# EAGLE design SuperUnioc_v1 (EAGLE 6.5.0)
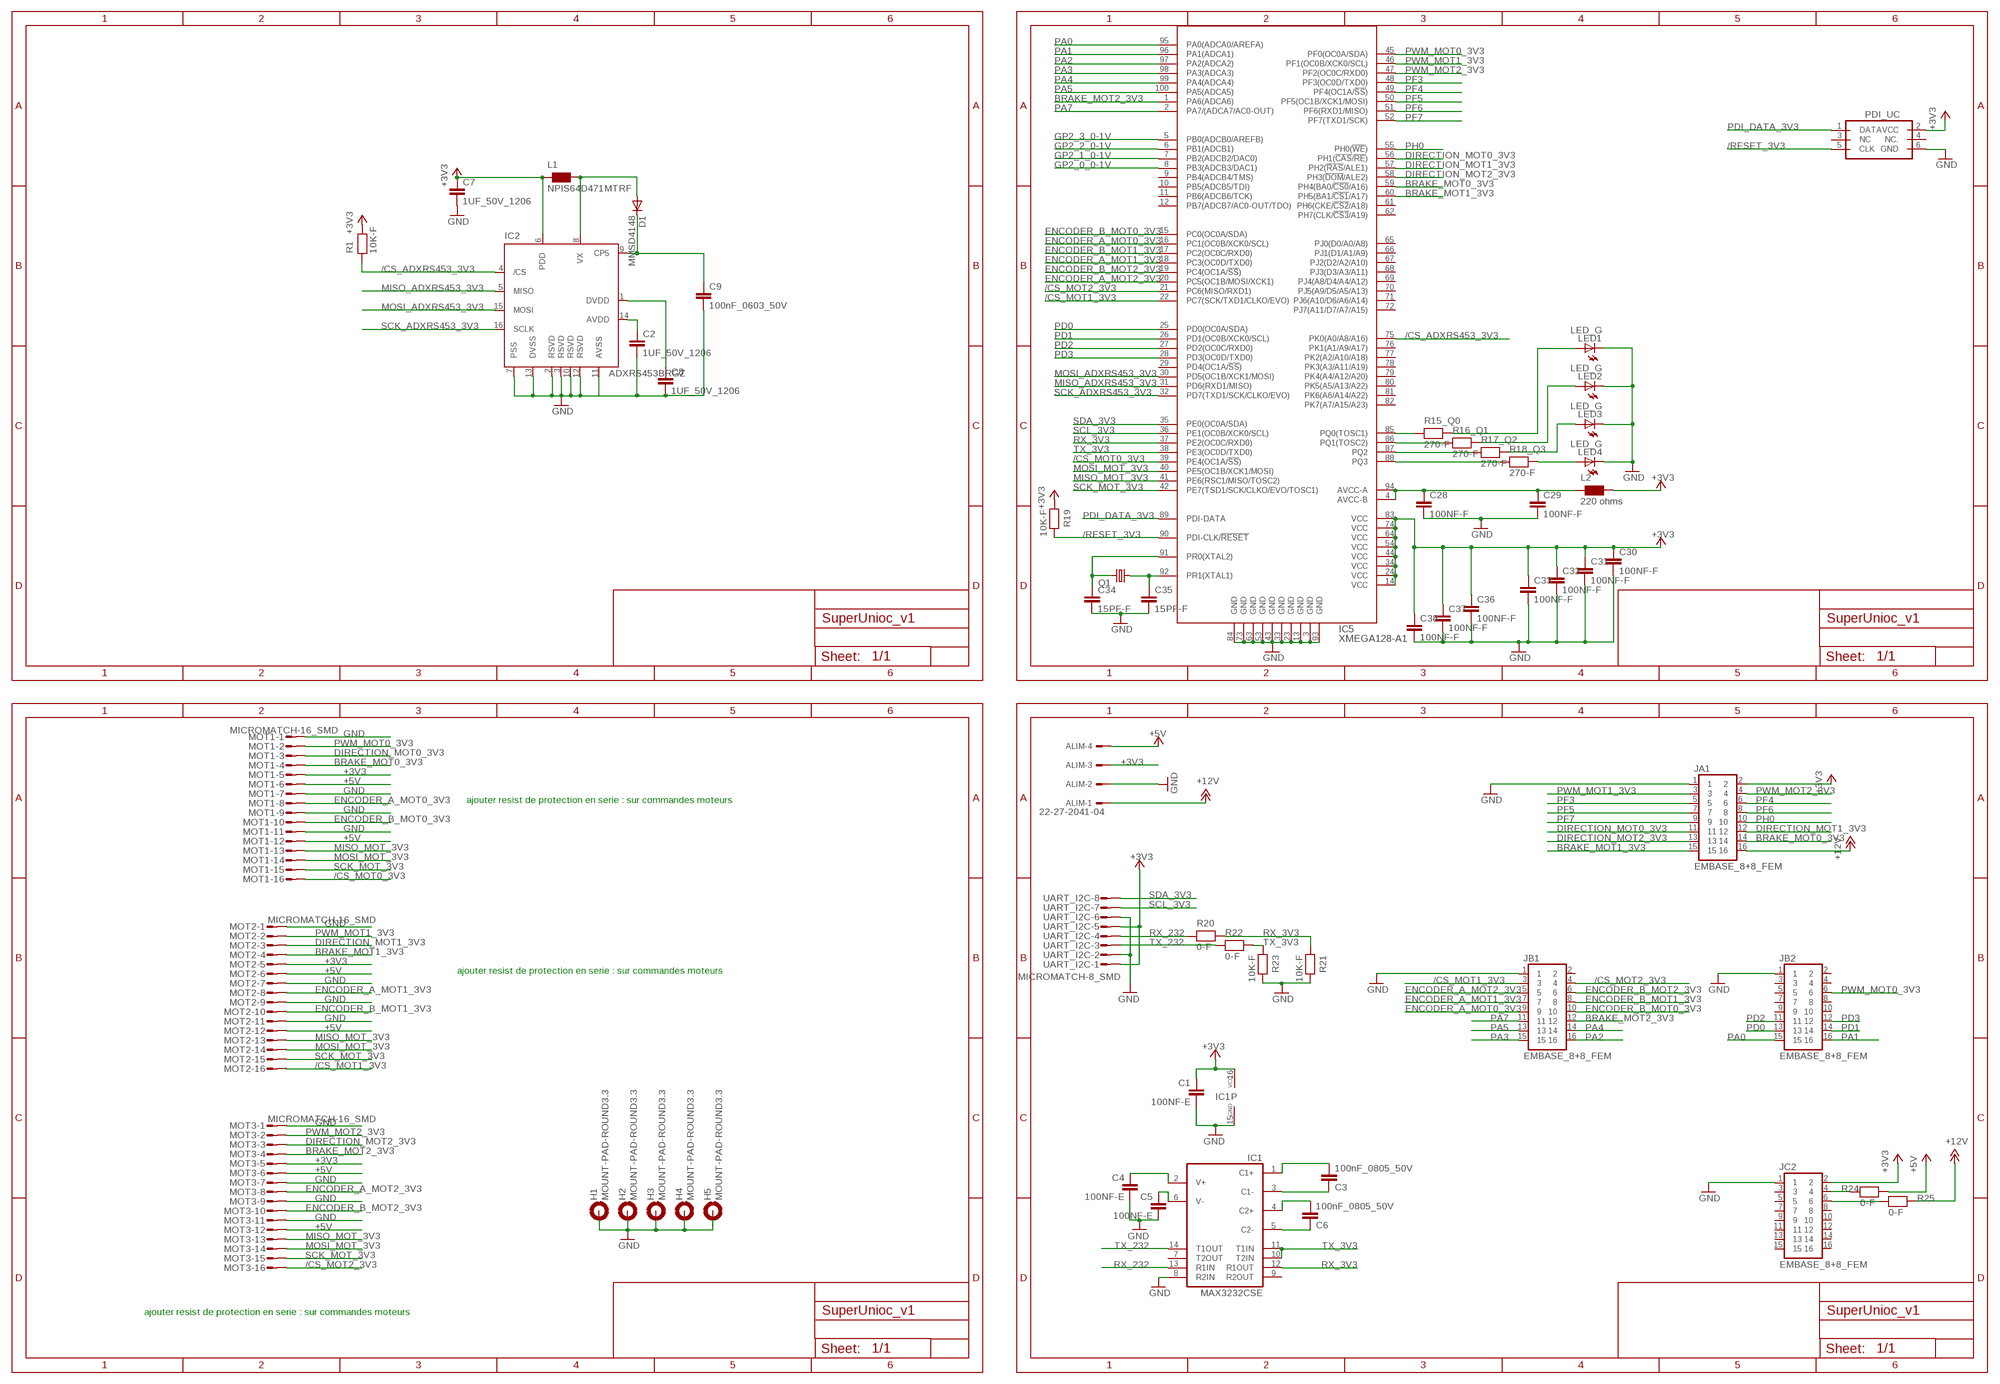
[diagram p0: schematic, sheet 1, part 1 of 2]
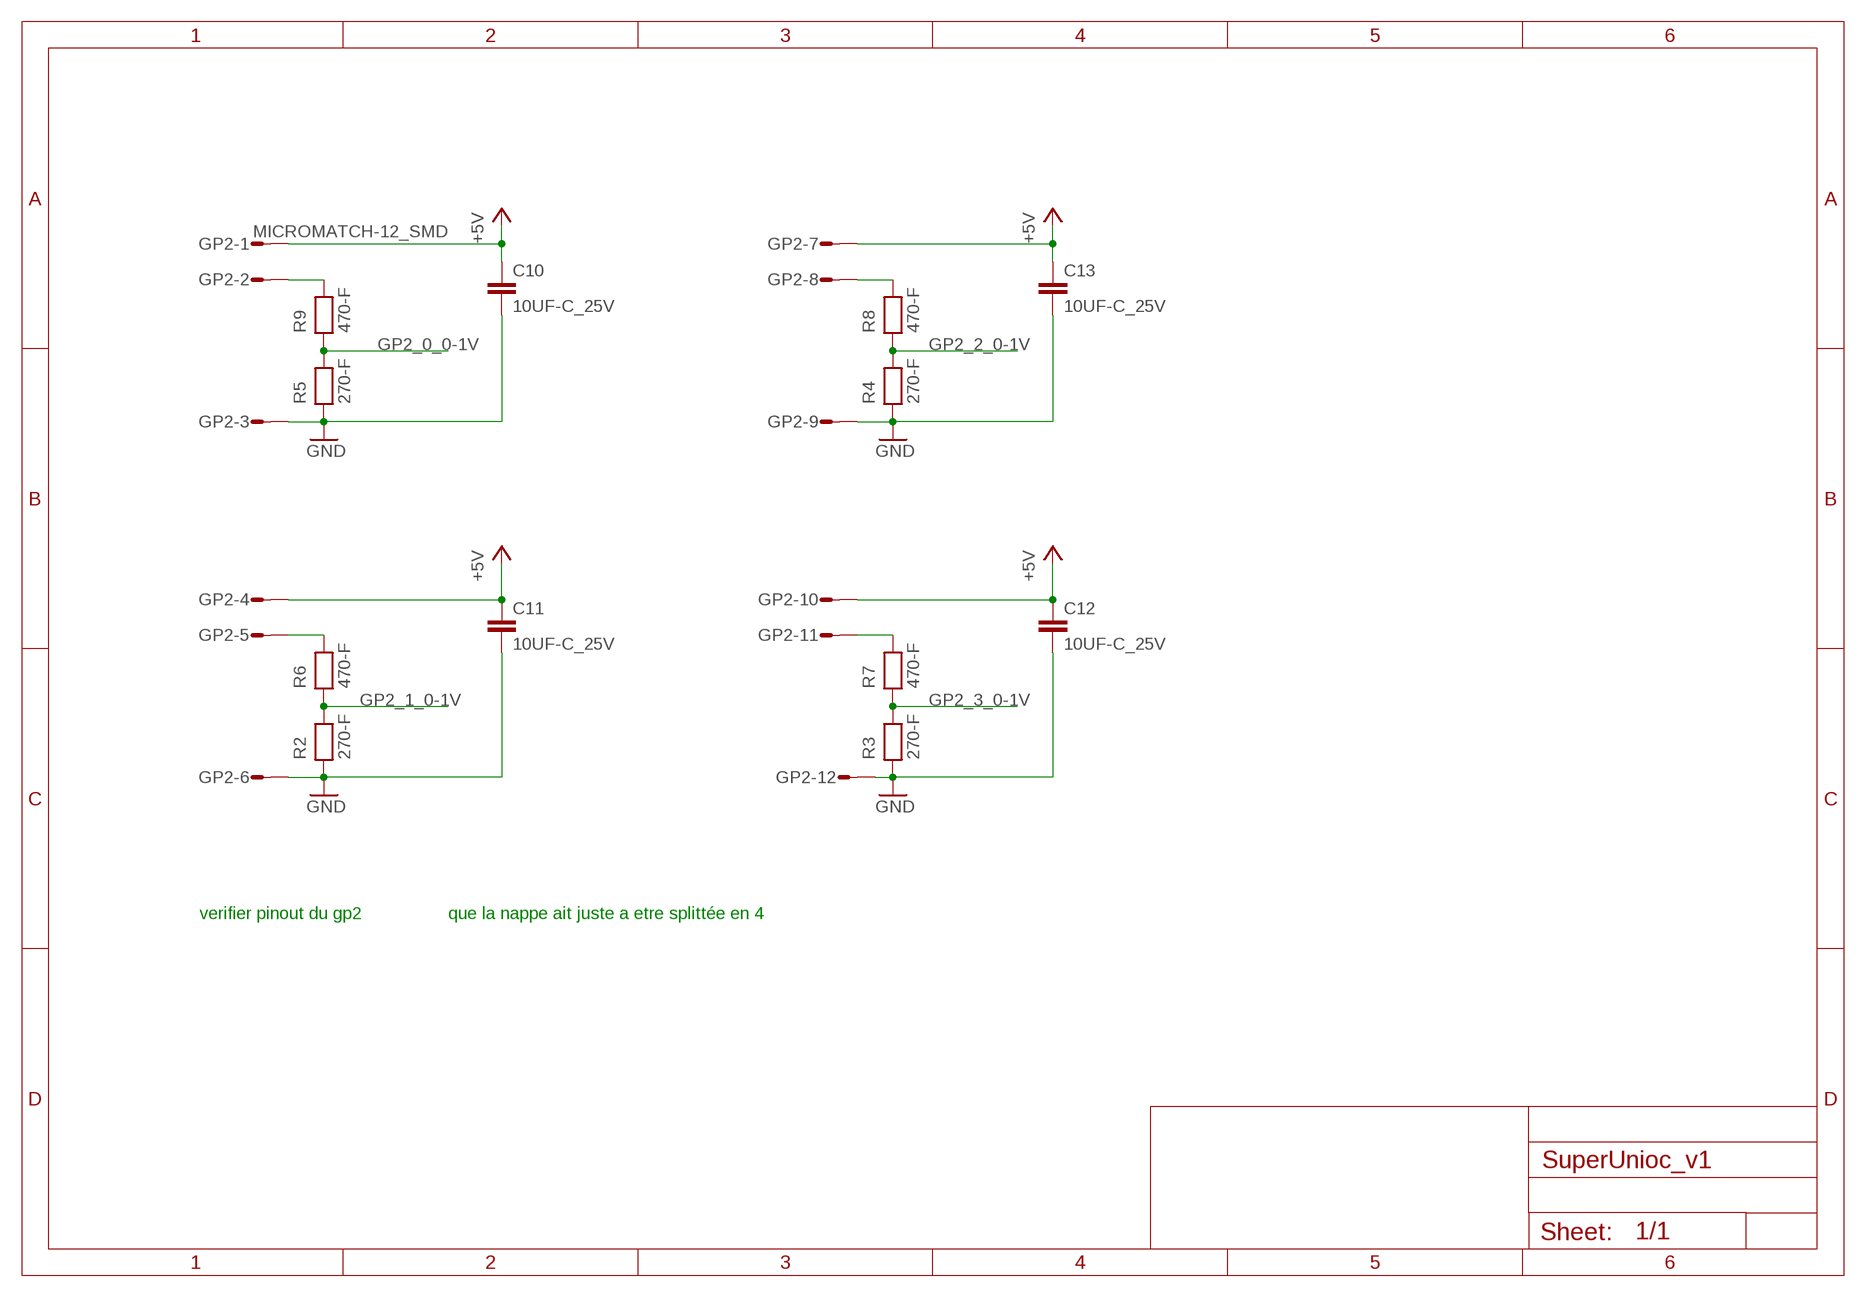
[diagram p1: schematic, sheet 1, part 2 of 2]

## Parts
ALIM  22-27-2041-04  [6410-04]
C1  100NF-E  [C0805]
C2  1UF_50V_1206  1UFD_25V  [C1206]
C3  100nF_0805_50V  100NF-E  [C0805]
C4  100NF-E  [C0805]
C5  100NF-E  [C0805]
C6  100nF_0805_50V  100NF-E  [C0805]
C7  1UF_50V_1206  1UFD_25V  [C1206]
C8  1UF_50V_1206  1UFD_25V  [C1206]
C9  100nF_0603_50V  100NF-F  [C0603]
C10  10UF-C_25V  [C1210]
C11  10UF-C_25V  [C1210]
C12  10UF-C_25V  [C1210]
C13  10UF-C_25V  [C1210]
C28  100NF-F  [C0603]
C29  100NF-F  [C0603]
C30  100NF-F  [C0603]
C31  100NF-F  [C0603]
C32  100NF-F  [C0603]
C33  100NF-F  [C0603]
C34  15PF-F  [C0603]
C35  15PF-F  [C0603]
C36  100NF-F  [C0603]
C37  100NF-F  [C0603]
C38  100NF-F  [C0603]
D1  MMSD4148  MMSD4148'  [SOD123]
GP2  MICROMATCH-12_SMD  [MICROMATCH-12_SMD]
H1  MOUNT-PAD-ROUND3.3  [3,3-PAD]
H2  MOUNT-PAD-ROUND3.3  [3,3-PAD]
H3  MOUNT-PAD-ROUND3.3  [3,3-PAD]
H4  MOUNT-PAD-ROUND3.3  [3,3-PAD]
H5  MOUNT-PAD-ROUND3.3  [3,3-PAD]
IC1  MAX3232CSE  [SO16]
IC2  ADXRS453BRGZ  ADXRS453BRG  [SO16_CAV]
IC5  XMEGA128-A1  XMEGA-A1TQFP  [TQFP100]
JA1  EMBASE_8+8_FEM  [EMBASE_8+8_FEM]
JB1  EMBASE_8+8_FEM  [EMBASE_8+8_FEM]
JB2  EMBASE_8+8_FEM  [EMBASE_8+8_FEM]
JC2  EMBASE_8+8_FEM  [EMBASE_8+8_FEM]
L1  NPIS64D471MTRF  [NPSIS_D64]
L2  220 ohms  FERRITE_220OHMS  [R0603]
LED1  LED_G  [CHIP-LED0805]
LED2  LED_G  [CHIP-LED0805]
LED3  LED_G  [CHIP-LED0805]
LED4  LED_G  [CHIP-LED0805]
MOT1  MICROMATCH-16_SMD  [MICROMATCH-16_SMD]
MOT2  MICROMATCH-16_SMD  [MICROMATCH-16_SMD]
MOT3  MICROMATCH-16_SMD  [MICROMATCH-16_SMD]
PDI_UC  PDI_ATMELL  [ML6L]
Q1  CRYSTAL_16MHZ_HC49UP  [HC49UP]
R1  10K-F  [R0603]
R2  270-F  [R0603]
R3  270-F  [R0603]
R4  270-F  [R0603]
R5  270-F  [R0603]
R6  470-F  [R0603]
R7  470-F  [R0603]
R8  470-F  [R0603]
R9  470-F  [R0603]
R15_Q0  270-F  [R0603]
R16_Q1  270-F  [R0603]
R17_Q2  270-F  [R0603]
R18_Q3  270-F  [R0603]
R19  10K-F  [R0603]
R20  0-F  [R0603]
R21  10K-F  [R0603]
R22  0-F  [R0603]
R23  10K-F  [R0603]
R24  0-F  [R0603]
R25  0-F  [R0603]
UART_I2C  MICROMATCH-8_SMD  [MICROMATCH-8_SMD]

## Nets
+3V3: ALIM.3 C1.1 C7.1 C30.1 C31.1 C32.1 C33.1 C36.1 C37.1 C38.1 IC1.16(VCC) IC2.6(PDD) IC5.14(VCC) IC5.24(VCC) IC5.34(VCC) IC5.44(VCC) IC5.54(VCC) IC5.64(VCC) IC5.74(VCC) IC5.83(VCC) JA1.2 JC2.2 L1.1 L2.2 MOT1.5 MOT2.5 MOT3.5 PDI_UC.2(VCC) R1.2 R19.1 UART_I2C.1 UART_I2C.5
+5V: ALIM.4 C10.1 C11.1 C12.1 C13.1 GP2.1 GP2.4 GP2.7 GP2.10 MOT1.6 MOT1.12 MOT2.6 MOT2.12 MOT3.6 MOT3.12 R24.2
+12V: ALIM.1 JA1.16 R25.2
/CS_ADXRS453_3V3: IC2.4(/CS) IC5.75(PK0(A0/A8/A16)) R1.1
/CS_MOT0_3V3: IC5.39(PE4(OC1A/!SS!)) MOT1.16
/CS_MOT1_3V3: IC5.22(PC7(SCK/TXD1/CLKO/EVO)) JB1.3 MOT2.16
/CS_MOT2_3V3: IC5.21(PC6(MISO/RXD1)) JB1.4 MOT3.16
/RESET_3V3: IC5.90(PDI-CLK/!RESET) PDI_UC.5(CLK) R19.2
BRAKE_MOT0_3V3: IC5.59(PH4(BA0/!CS0!/A16)) JA1.14 MOT1.4
BRAKE_MOT1_3V3: IC5.60(PH5(BA1/!CS1!/A17)) JA1.15 MOT2.4
BRAKE_MOT2_3V3: IC5.1(PA6(ADCA6)) JB1.12 MOT3.4
DIRECTION_MOT0_3V3: IC5.56(PH1(!CAS!/!RE!)) JA1.11 MOT1.3
DIRECTION_MOT1_3V3: IC5.57(PH2(!RAS!/ALE1)) JA1.12 MOT2.3
DIRECTION_MOT2_3V3: IC5.58(PH3(!DOM!/ALE2)) JA1.13 MOT3.3
ENCODER_A_MOT0_3V3: IC5.16(PC1(OC0B/XCK0/SCL)) JB1.9 MOT1.8
ENCODER_A_MOT1_3V3: IC5.18(PC3(OC0D/TXD0)) JB1.7 MOT2.8
ENCODER_A_MOT2_3V3: IC5.20(PC5(OC1B/MOSI/XCK1)) JB1.5 MOT3.8
ENCODER_B_MOT0_3V3: IC5.15(PC0(OC0A/SDA)) JB1.10 MOT1.10
ENCODER_B_MOT1_3V3: IC5.17(PC2(OC0C/RXD0)) JB1.8 MOT2.10
ENCODER_B_MOT2_3V3: IC5.19(PC4(OC1A/!SS!)) JB1.6 MOT3.10
GND: ALIM.2 C1.2 C2.2 C4.2 C5.2 C7.2 C8.2 C9.2 C10.2 C11.2 C12.2 C13.2 C28.2 C29.2 C30.2 C31.2 C32.2 C33.2 C34.2 C35.2 C36.2 C37.2 C38.2 GP2.3 GP2.6 GP2.9 GP2.12 H1.B3,3(MOUNT) H2.B3,3(MOUNT) H3.B3,3(MOUNT) H4.B3,3(MOUNT) H5.B3,3(MOUNT) IC1.8(R2IN) IC1.15(GND) IC2.2(RSVD) IC2.3(RSVD) IC2.7(PSS) IC2.10(RSVD) IC2.11(AVSS) IC2.12(RSVD) IC2.13(DVSS) IC5.3(GND) IC5.13(GND) IC5.23(GND) IC5.33(GND) IC5.43(GND) IC5.53(GND) IC5.63(GND) IC5.73(GND) IC5.84(GND) IC5.93(GND) JA1.1 JB1.1 JB2.1 JC2.1 LED1.C LED2.C LED3.C LED4.C MOT1.1 MOT1.7 MOT1.9 MOT1.11 MOT2.1 MOT2.7 MOT2.9 MOT2.11 MOT3.1 MOT3.7 MOT3.9 MOT3.11 PDI_UC.6(GND) R2.1 R3.1 R4.1 R5.1 R21.2 R23.2 UART_I2C.2 UART_I2C.6
GP2_0_0-1V: IC5.8(PB3(ADCB3/DAC1)) R5.2 R9.1
GP2_1_0-1V: IC5.7(PB2(ADCB2/DAC0)) R2.2 R6.1
GP2_2_0-1V: IC5.6(PB1(ADCB1)) R4.2 R8.1
GP2_3_0-1V: IC5.5(PB0(ADCB0/AREFB)) R3.2 R7.1
MISO_ADXRS453_3V3: IC2.5(MISO) IC5.31(PD6(RXD1/MISO))
MISO_MOT_3V3: IC5.41(PE6(RSC1/MISO/TOSC2)) MOT1.13 MOT2.13 MOT3.13
MOSI_ADXRS453_3V3: IC2.15(MOSI) IC5.30(PD5(OC1B/XCK1/MOSI))
MOSI_MOT_3V3: IC5.40(PE5(OC1B/XCK1/MOSI)) MOT1.14 MOT2.14 MOT3.14
N$1: JC2.4 R24.1
N$2: C3.1 IC1.1(C1+)
N$3: C6.1 IC1.4(C2+)
N$4: LED4.A R18_Q3.2
N$5: C3.2 IC1.3(C1-)
N$6: IC5.88(PQ3) R18_Q3.1
N$7: C34.1 IC5.91(PR0(XTAL2)) Q1.2
N$8: C35.1 IC5.92(PR1(XTAL1)) Q1.1
N$9: IC5.87(PQ2) R17_Q2.1
N$10: IC5.86(PQ1(TOSC2)) R16_Q1.1
N$11: IC5.85(PQ0(TOSC1)) R15_Q0.1
N$12: LED1.A R15_Q0.2
N$13: LED2.A R16_Q1.2
N$14: LED3.A R17_Q2.2
N$15: JC2.6 R25.1
N$16: C6.2 IC1.5(C2-)
N$17: C4.1 IC1.2(V+)
N$18: D1.A IC2.8(VX) L1.2
N$19: C2.1 IC2.14(AVDD)
N$20: C5.1 IC1.6(V-)
N$21: C8.1 IC2.1(DVDD)
N$22: GP2.8 R8.2
N$23: C9.1 D1.C IC2.9(CP5)
N$24: GP2.2 R9.2
N$25: C28.1 C29.1 IC5.4(AVCC-B) IC5.94(AVCC-A) L2.1
N$36: GP2.11 R7.2
N$37: GP2.5 R6.2
PA0: IC5.95(PA0(ADCA0/AREFA)) JB2.15
PA1: IC5.96(PA1(ADCA1)) JB2.16
PA2: IC5.97(PA2(ADCA2)) JB1.16
PA3: IC5.98(PA3(ADCA3)) JB1.15
PA4: IC5.99(PA4(ADCA4)) JB1.14
PA5: IC5.100(PA5(ADCA5)) JB1.13
PA7: IC5.2(PA7/(ADCA7/AC0-OUT)) JB1.11
PD0: IC5.25(PD0(OC0A/SDA)) JB2.13
PD1: IC5.26(PD1(OC0B/XCK0/SCL)) JB2.14
PD2: IC5.27(PD2(OC0C/RXD0)) JB2.11
PD3: IC5.28(PD3(OC0D/TXD0)) JB2.12
PDI_DATA_3V3: IC5.89(PDI-DATA) PDI_UC.1(DATA)
PF3: IC5.48(PF3(OC0D/TXD0)) JA1.5
PF4: IC5.49(PF4(OC1A/!SS!)) JA1.6
PF5: IC5.50(PF5(OC1B/XCK1/MOSI)) JA1.7
PF6: IC5.51(PF6(RXD1/MISO)) JA1.8
PF7: IC5.52(PF7(TXD1/SCK)) JA1.9
PH0: IC5.55(PH0(!WE!)) JA1.10
PWM_MOT0_3V3: IC5.45(PF0(OC0A/SDA)) JB2.6 MOT1.2
PWM_MOT1_3V3: IC5.46(PF1(OC0B/XCK0/SCL)) JA1.3 MOT2.2
PWM_MOT2_3V3: IC5.47(PF2(OC0C/RXD0)) JA1.4 MOT3.2
RX_3V3: IC1.12(R1OUT) IC5.37(PE2(OC0C/RXD0)) R20.2 R21.1
RX_232: IC1.13(R1IN) R20.1 UART_I2C.4
SCK_ADXRS453_3V3: IC2.16(SCLK) IC5.32(PD7(TXD1/SCK/CLKO/EVO))
SCK_MOT_3V3: IC5.42(PE7(TSD1/SCK/CLKO/EVO/TOSC1)) MOT1.15 MOT2.15 MOT3.15
SCL_3V3: IC5.36(PE1(OC0B/XCK0/SCL)) UART_I2C.7
SDA_3V3: IC5.35(PE0(OC0A/SDA)) UART_I2C.8
TX_3V3: IC1.10(T2IN) IC1.11(T1IN) IC5.38(PE3(OC0D/TXD0)) R22.2 R23.1
TX_232: IC1.14(T1OUT) R22.1 UART_I2C.3
Unconnected: IC1.7(T2OUT) IC1.9(R2OUT) IC5.9(PB4(ADCB4/TMS)) IC5.10(PB5(ADCB5/TDI)) IC5.11(PB6(ADCB6/TCK)) IC5.12(PB7(ADCB7/AC0-OUT/TDO)) IC5.29(PD4(OC1A/!SS!)) IC5.61(PH6(CKE/!CS2!/A18)) IC5.62(PH7(CLK/!CS3!/A19)) IC5.65(PJ0(D0/A0/A8)) IC5.66(PJ1(D1/A1/A9)) IC5.67(PJ2(D2/A2/A10)) IC5.68(PJ3(D3/A3/A11)) IC5.69(PJ4(A8/D4/A4/A12)) IC5.70(PJ5(A9/D5/A5/A13)) IC5.71(PJ6(A10/D6/A6/A14)) IC5.72(PJ7(A11/D7/A7/A15)) IC5.76(PK1(A1/A9/A17)) IC5.77(PK2(A2/A10/A18)) IC5.78(PK3(A3/A11/A19)) IC5.79(PK4(A4/A12/A20)) IC5.80(PK5(A5/A13/A22)) IC5.81(PK6(A6/A14/A22)) IC5.82(PK7(A7/A15/A23)) JB1.2 JB2.2 JB2.3 JB2.4 JB2.5 JB2.7 JB2.8 JB2.9 JB2.10 JC2.3 JC2.5 JC2.7 JC2.8 JC2.9 JC2.10 JC2.11 JC2.12 JC2.13 JC2.14 JC2.15 JC2.16 PDI_UC.3(NC) PDI_UC.4(NC.)

## Notes on the sheet
- ajouter resist de protection en serie : sur commandes moteurs
- ajouter resist de protection en serie : sur commandes moteurs
- ajouter resist de protection en serie : sur commandes moteurs
- verifier pinout du gp2 | que la nappe ait juste a etre splittée en 4

## Library data of the parts
ALIM = con-molex:22-?-04: CONNECTOR wire to board 2.54 mm (.1 inch) pitch header; OC_FARNELL: unknown; OC_NEWARK: unknown
C1 C3-C6 = robotter_capacitor:100NF; MOUSER: 81-GRM40Y104Z50D; RS: 220-7966; VALUE: 100nF 50V
C2 C7 C8 = robotter_capacitor:1UF; MOUSER: 810-C3216X7R1E105K-6; RS: 740-7574; VALUE: 1µF 25V
C9 C28-C33 C36-C38 = robotter_capacitor:100NF; MOUSER: 81-GRM188F51H104ZA01; RS: 723-5534; VALUE: 100nF 50V
C10-C13 = robotter_capacitor:10UF; MOUSER: 963-TMK316BJ106KL-T; RS: 766-1185; VALUE: 10µF 25V
C34 C35 = robotter_capacitor:15PF; MOUSER: 581-06031A150K4T2A; RS: 147-421; VALUE: 15pF_0603_100V
D1 = robotter_ic:MMSD4148; MOUSER: 863-MMSD4148T1G; RS: 464-198
GP2 = robotter_connector:MICROMATCH-12_SMD: Ref FN : 1565589; MOUSER: 571-8-188275-2; RS: 739-1230
H1-H5 = holes:MOUNT-PAD-ROUND: MOUNTING PAD, round
IC1 = robotter_ic:MAX3232: True RS-232 Transceivers 3.0V to 5.5V, Low-Power up to 1Mbps, Using Four 0.1µF External Capacitors Source: http://pdfserv.maxim-ic.com/en/ds/MAX3222-MAX3241.pdf; MOUSER: 511-ST3232CDR; RS: 415-2105
IC2 = robotter_ic:ADXRS453; FARNELL: 2377130; MOUSER: 584-ADXRS453BRGZ
IC5 = avr-7:XMEGA-A1: Atmel XMega A1 Series processor
JA1 JB1 JB2 JC2 = robotter_connector:EMBASE_8+8_FEM; FARNELL: 1109794; MOUSER: 855-M22-7140842; RS: 605-8847
L1 = robotter_inductor:NPIS64D; RS: 741-9271
L2 = robotter_inductor:FERRITE_220OHMS; MOUSER: 81-BLM18BB221SN1D; RS: 724-1302
LED1-LED4 = robotter_diode:LED_; MOUSER: 859-LTST-C171GKT; RS: 692-0935; VALUE: GREEN
MOT1-MOT3 = robotter_connector:MICROMATCH-16_SMD: MicroMaTch 16 FN : 1565592 / 8-215464-6 / 1-215464-6 Drawing Number C-215464 DDEController.pdf; MOUSER: 571-8-188275-6; RS: 739-1237
PDI_UC = robotter_connector:PDI_ATMEL: Ref Harting : 09 18 506 7323 Atmel pdi connector; MOUSER: 617-09-18-506-7323; RS: 693-5242
Q1 = robotter_ic:CRYSTAL_: CRYSTAL; MOUSER: 559-FOXSD160-20-LF; RS: 547-6531; VALUE: 16 MHz
R1 R19 R21 R23 = robotter_resistor:10K; MOUSER: 652-CR0603-JW-103ELF; RS: 740-8899
R2-R5 R15_Q0 R16_Q1 R17_Q2 R18_Q3 = robotter_resistor:270; MOUSER: 71-CRCW0603J-270-E3; RS: 679-0071
R6-R9 = robotter_resistor:470; MOUSER: 279-CRG0603F470R; RS: 213-2222; VALUE: 470
R20 R22 R24 R25 = robotter_resistor:0
UART_I2C = robotter_connector:MICROMATCH-8_SMD: Ref FN : 1865096; FARNELL: 1865096; MOUSER: 571-7-188275-8; RS: 739-1227

## Board
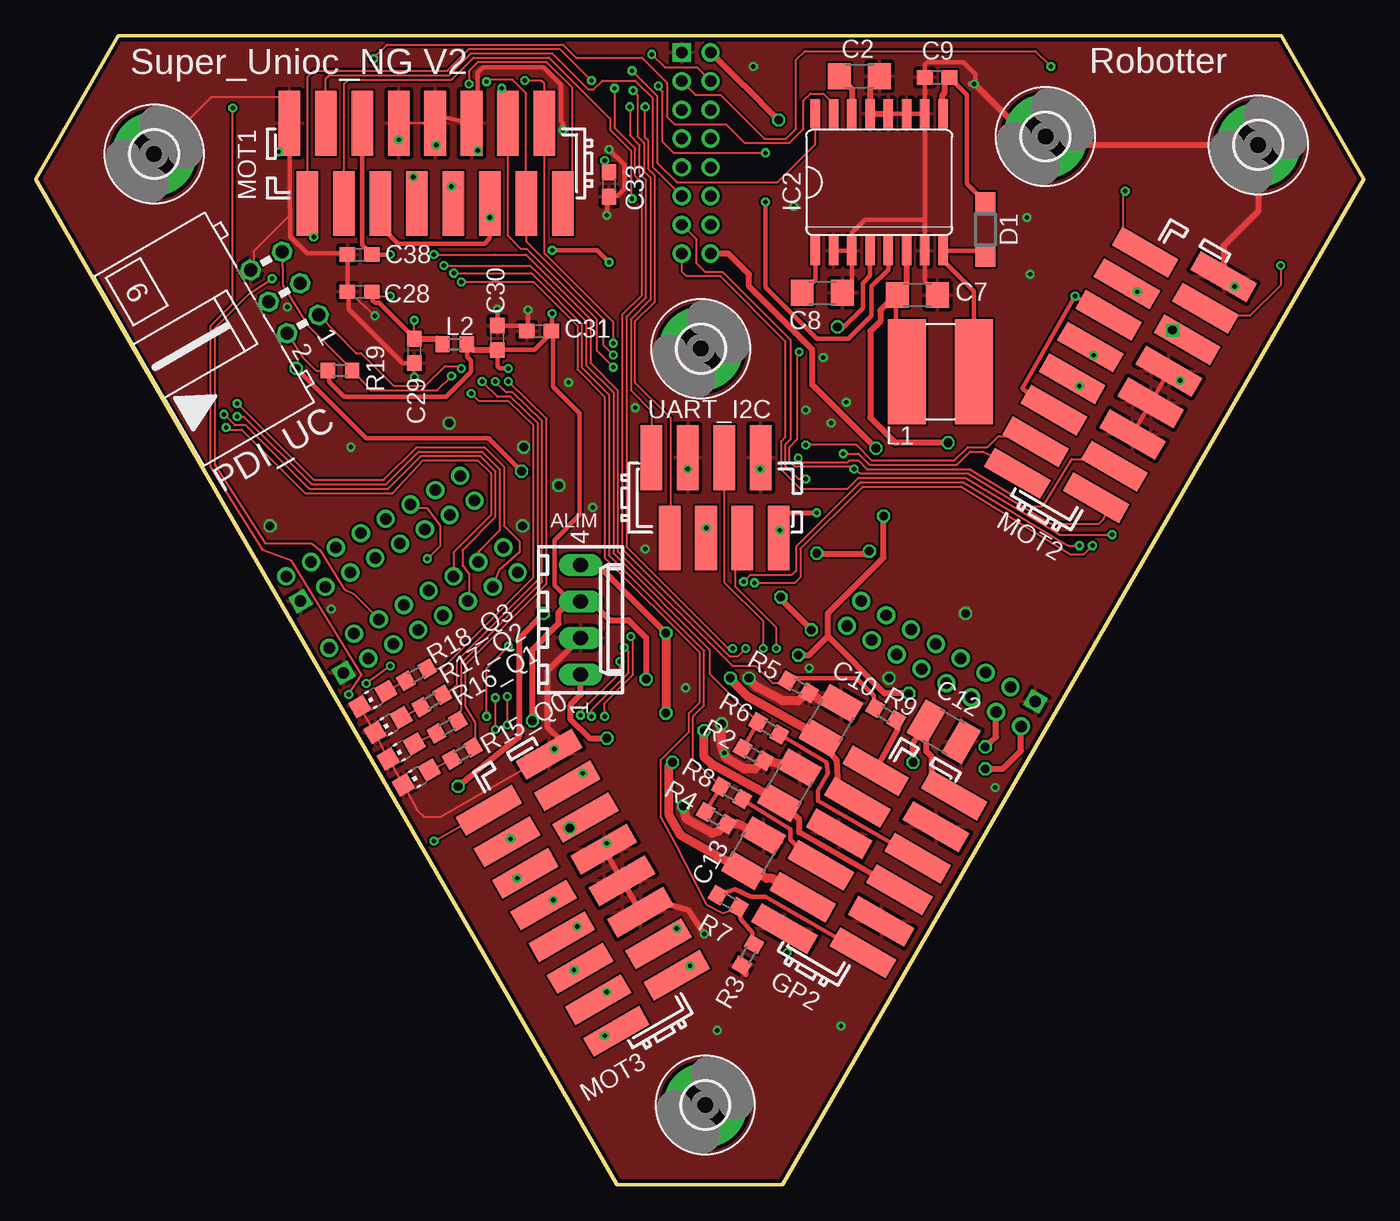
[diagram p2: board, top side]
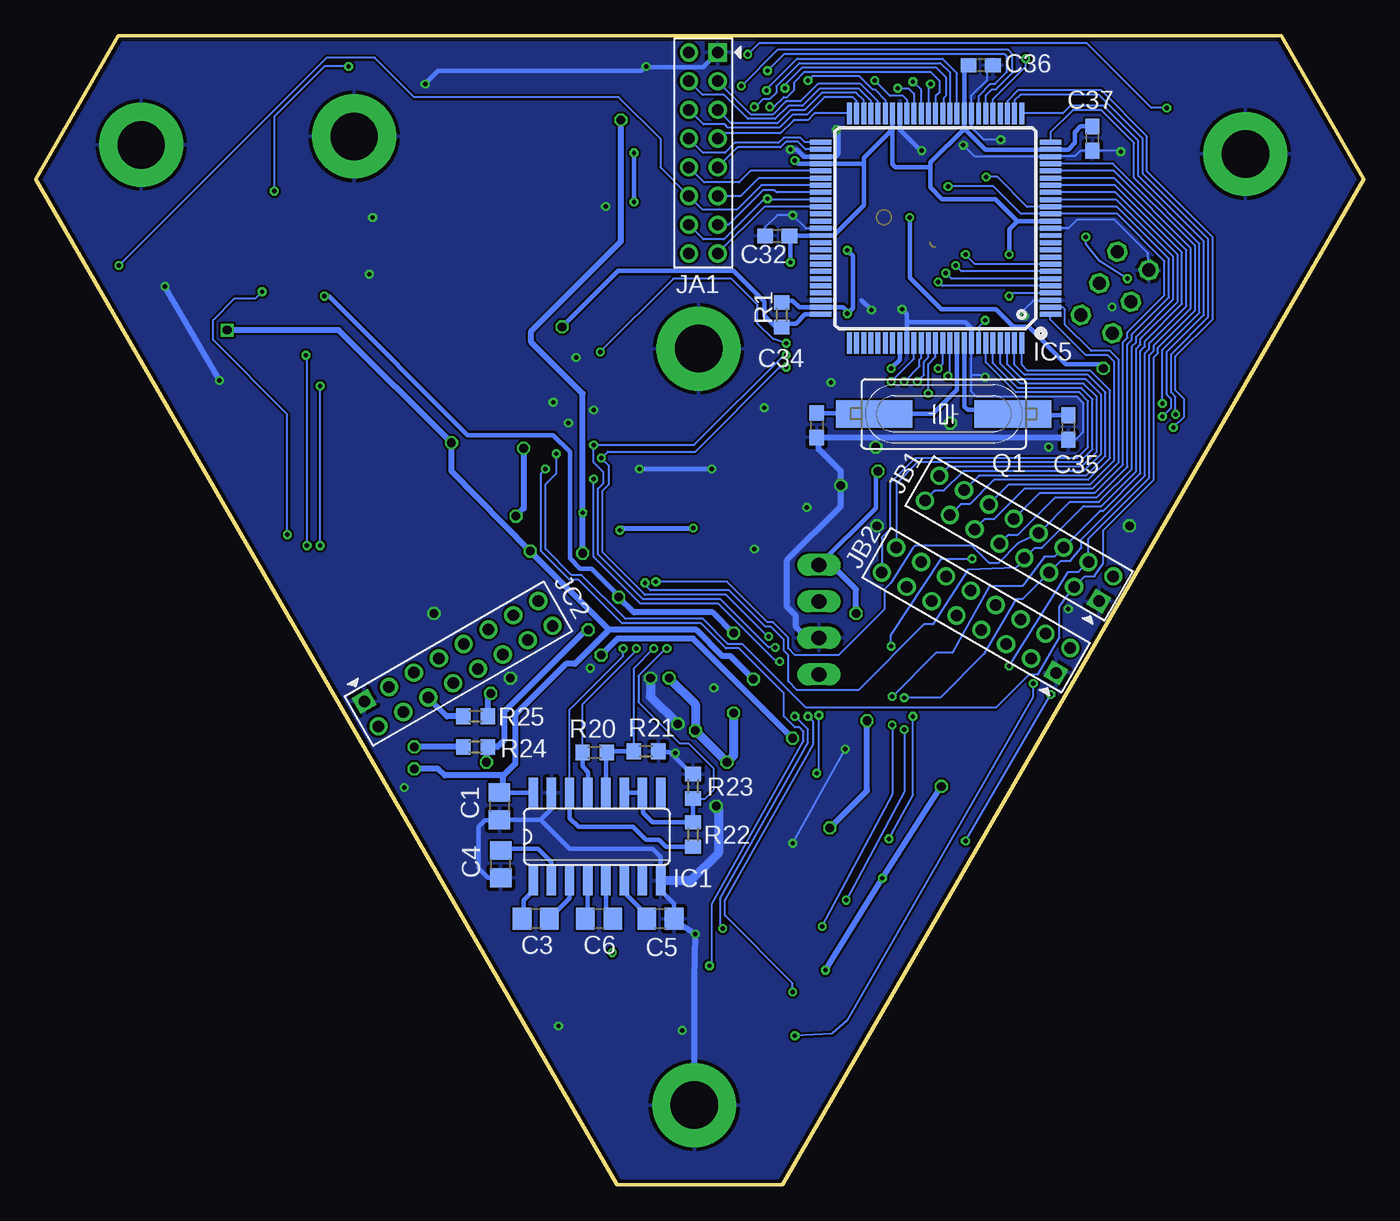
[diagram p3: board, bottom side, seen from below]

Size 92.5 x 80 mm. Coordinates in mm from the lower left corner, seen from the top.
Outline: 5.75,80 86.75,80 92.5,70 52,0 40.5,0 0,70 5.75,80
Copper layers (1*16): Top 0.035mm / dielectric 1.6mm / Bottom 0.035mm
Design rules "SeeedStudio_DRU_2layer": minimum track width 6mil, minimum drill 12mil, track to track 6mil, track to pad 6mil, pad to pad 6mil, via to via 6mil, smd to smd 0mil, copper to edge 10mil, drill to drill 10mil, minimum pad ring 6mil, minimum via ring 6mil, stop-mask expansion 2mil, vias tented up to drill 25mil, thermal gap 10mil

### Footprints (pad centres in the part's own frame; a part is rotated, then mirrored left to right if it is on the bottom)
6410-04 = drill 1.016 long: 1 3.81,0; 2 1.27,0; 3 -1.27,0; 4 -3.81,0
C0805 = smd 1.3 x 1.5: 1 -0.95,0; 2 0.95,0
C1206 = smd 1.6 x 1.8: 1 -1.4,0; 2 1.4,0
C0603 = smd 1.1 x 1: 1 -0.85,0; 2 0.85,0
C1210 = smd 1.6 x 2.7: 1 -1.4,0; 2 1.4,0
SOD123 = smd 1.4 x 1.4: A 1.9,0; C -1.9,0
MICROMATCH-12_SMD = smd 1.5 x 4.5: 1 6.985,-2.794; 2 5.715,2.794; 3 4.445,-2.794; 4 3.175,2.794; 5 1.905,-2.794; 6 0.635,2.794; 7 -0.635,-2.794; 8 -1.905,2.794; 9 -3.175,-2.794; 10 -4.445,2.794; 11 -5.715,-2.794; 12 -6.985,2.794
3,3-PAD = drill 3.3 pad 5.842: B3,3 0,0
SO16 = smd 0.66 x 2.032: 1 -4.445,-3.073; 2 -3.175,-3.073; 3 -1.905,-3.073; 4 -0.635,-3.073; 5 0.635,-3.073; 6 1.905,-3.073; 7 3.175,-3.073; 8 4.445,-3.073; 9 4.445,3.073; 10 3.175,3.073; 11 1.905,3.073; 12 0.635,3.073; 13 -0.635,3.073; 14 -1.905,3.073; 15 -3.175,3.073; 16 -4.445,3.073
SO16_CAV = smd 0.66 x 2.032: 1 -4.445,-4.77; 2 -3.175,-4.77; 3 -1.905,-4.77; 4 -0.635,-4.77; 5 0.635,-4.77; 6 1.905,-4.77; 7 3.175,-4.77; 8 4.445,-4.77; 9 4.445,4.77; 10 3.175,4.77; 11 1.905,4.77; 12 0.635,4.77; 13 -0.635,4.77; 14 -1.905,4.77; 15 -3.175,4.77; 16 -4.445,4.77
TQFP100 = smd 1.5 x 0.347: 1 -8,6; 2 -8,5.5; 3 -8,5; 4 -8,4.5; 5 -8,4; 6 -8,3.5; 7 -8,3; 8 -8,2.5; 9 -8,2; 10 -8,1.5; 11 -8,1; 12 -8,0.5; 13 -8,0; 14 -8,-0.5; 15 -8,-1; 16 -8,-1.5; 17 -8,-2; 18 -8,-2.5; 19 -8,-3; 20 -8,-3.5; 21 -8,-4; 22 -8,-4.5; 23 -8,-5; 24 -8,-5.5; 25 -8,-6; 51 8,-6; 52 8,-5.5; 53 8,-5; 54 8,-4.5; 55 8,-4; 56 8,-3.5; 57 8,-3; 58 8,-2.5; 59 8,-2; 60 8,-1.5; 61 8,-1; 62 8,-0.5; 63 8,0; 64 8,0.5; 65 8,1; 66 8,1.5; 67 8,2; 68 8,2.5; 69 8,3; 70 8,3.5; 71 8,4; 72 8,4.5; 73 8,5; 74 8,5.5; 75 8,6 | smd 0.347 x 1.5: 26 -6,-8; 27 -5.5,-8; 28 -5,-8; 29 -4.5,-8; 30 -4,-8; 31 -3.5,-8; 32 -3,-8; 33 -2.5,-8; 34 -2,-8; 35 -1.5,-8; 36 -1,-8; 37 -0.5,-8; 38 0,-8; 39 0.5,-8; 40 1,-8; 41 1.5,-8; 42 2,-8; 43 2.5,-8; 44 3,-8; 45 3.5,-8; 46 4,-8; 47 4.5,-8; 48 5,-8; 49 5.5,-8; 50 6,-8; 76 6,8; 77 5.5,8; 78 5,8; 79 4.5,8; 80 4,8; 81 3.5,8; 82 3,8; 83 2.5,8; 84 2,8; 85 1.5,8; 86 1,8; 87 0.5,8; 88 0,8; 89 -0.5,8; 90 -1,8; 91 -1.5,8; 92 -2,8; 93 -2.5,8; 94 -3,8; 95 -3.5,8; 96 -4,8; 97 -4.5,8; 98 -5,8; 99 -5.5,8; 100 -6,8
EMBASE_8+8_FEM = drill 0.8 pad 1.27 square: 1 -7,1 | drill 0.8 pad 1.27: 2 -7,-1; 3 -5,1; 4 -5,-1; 5 -3,1; 6 -3,-1; 7 -1,1; 8 -1,-1; 9 1,1; 10 1,-1; 11 3,1; 12 3,-1; 13 5,1; 14 5,-1; 15 7,1; 16 7,-1
NPSIS_D64 = smd 2.65 x 7.3: 1 -2.325,0; 2 2.325,0
R0603 = smd 1 x 1.1: 1 -0.85,0; 2 0.85,0
CHIP-LED0805 = smd 1.2 x 1.2: A 0,-1.05; C 0,1.05
MICROMATCH-16_SMD = smd 1.5 x 4.5: 1 9.525,-2.794; 2 8.255,2.794; 3 6.985,-2.794; 4 5.715,2.794; 5 4.445,-2.794; 6 3.175,2.794; 7 1.905,-2.794; 8 0.635,2.794; 9 -0.635,-2.794; 10 -1.905,2.794; 11 -3.175,-2.794; 12 -4.445,2.794; 13 -5.715,-2.794; 14 -6.985,2.794; 15 -8.255,-2.794; 16 -9.525,2.794
ML6L = drill 0.914 octagon: 1 -2.54,-1.27; 2 -2.54,1.27; 3 0,-1.27; 4 0,1.27; 5 2.54,-1.27; 6 2.54,1.27
HC49UP = smd 5.334 x 1.93: 1 -4.826,0; 2 4.826,0
MICROMATCH-8_SMD = smd 1.5 x 4.5: 1 4.445,-2.794; 2 3.175,2.794; 3 1.905,-2.794; 4 0.635,2.794; 5 -0.635,-2.794; 6 -1.905,2.794; 7 -3.175,-2.794; 8 -4.445,2.794

### Placement (x,y rotation side)
ALIM  37.95,39.34 270 top
C1  60.2,26.37 270 bottom
C2  57.38,77.19 0 top
C3  57.68,18.52 0 bottom
C4  60.12,22.33 270 bottom
C5  49,18.52 0 bottom
C6  53.26,18.52 0 bottom
C7  61.42,61.95 0 top
C8  54.79,62.1 0 top
C9  62.79,77.11 180 top
C10  55.4,32.31 60 top
C11  52.5,27.81 60 top
C12  63.25,31.55 330 top
C13  49.99,23.09 60 top
C28  22.56,62.18 180 top
C29  26.37,58.06 270 top
C30  32.16,58.98 90 top
C31  35.05,59.44 180 top
C32  40.84,66.07 180 bottom
C33  39.93,69.65 270 top
C34  38.1,52.88 270 bottom
C35  20.57,52.73 270 bottom
C36  26.67,77.95 0 bottom
C37  18.9,72.85 270 bottom
C38  22.56,64.77 180 top
D1  66.14,66.52 270 top
GP2  58.06,22.48 60 top
H1  46.63,5.54 0 top
H2  8.24,71.78 0 top
H3  85.16,72.41 0 top
H4  46.33,58.22 0 top
H5  70.33,73 0 top
IC1  53.42,24.23 0 bottom
IC2  58.75,69.8 0 top
IC5  29.82,66.6 180 bottom
JA1  46,71.85 270 bottom
JB1  24,45 150 bottom
JB2  27,40 150 bottom
JC2  63.07,36.29 30 bottom
L1  63.02,56.62 0 top
L2  29.18,58.52 0 top
LED1  26.52,28.35 120 top
LED2  25.45,30.18 120 top
LED3  24.54,32 120 top
LED4  23.47,33.83 120 top
MOT1  27.18,71.12 180 top
MOT2  75.56,56.39 60 top
MOT3  38.1,20.32 120 top
PDI_UC  17.32,62.13 120 top
Q1  29.26,53.67 180 bottom
R1  40.54,60.58 90 bottom
R2  49.99,29.95 150 top
R3  49.61,16 60 top
R4  47.4,25.53 150 top
R5  53.11,34.67 150 top
R6  51.05,31.78 330 top
R7  48.23,19.74 150 top
R8  48.46,27.28 330 top
R9  59.21,32.77 330 top
R15_Q0  29.72,30.02 210 top
R16_Q1  28.65,31.85 210 top
R17_Q2  27.58,33.68 210 top
R18_Q3  26.52,35.51 210 top
R19  21.18,56.69 0 top
R20  53.57,30.1 0 bottom
R21  49.99,30.18 0 bottom
R22  46.71,24.38 90 bottom
R23  46.71,27.74 90 bottom
R24  61.87,30.48 0 bottom
R25  61.87,32.61 0 bottom
UART_I2C  47.32,47.83 0 top

### Tracks (layer width: path | path; a pad name or v marks a point on that pad's centre or on a via)
+3V3  (via drill 0.3, 0.3 pad 0.6, 0.6)
  Top 0.152: 39.62,70.8 C33.1 | PDI_UC.2 18.59,57.61 19.51,56.69 R19.1 | v37.19,24.84 MOT3.5
  Top 0.305: v24.69,64.77 C38.1 22.73,65.44 MOT1.5 | v32.92,56.84 32.31,56.84 32.16,57 C30.1 34.73,58.13 35.89,59.28 C31.1 | v39.62,71.32 39.62,70.8 | C31.1 35.97,59.65 v35.97,60.66 | 78.64,59.13 78.95,58.98 79.23,58.84 MOT2.5 | 38.02,40.69 ALIM.3 37.19,40.69 36.12,41.76 36.12,44.88 37.87,46.63 37.87,53.72 36.04,55.55 36.04,59.3 C31.1 | 60.66,64.01 IC2.6 | C7.1 59.97,61.87 59.93,61.84 59.93,58.61 L1.1 | R19.1 20.42,56.6 20.42,55.93 21.49,54.86 28.57,54.86 30.33,56.62 30.33,57.38 30.04,57.67 L2.2 | v35.97,65.08 39.09,65.08 v39.93,64.24
  Top 0.356: v54.41,46.79 52.2,46.79 52.05,46.63 52.05,45.31 UART_I2C.1 51.82,45.09 v51.82,45.57 | v46.71,45.72 46.69,45.7 UART_I2C.5
  Top 0.406: v34.59,32.31 34.59,37.26 36.42,39.09 36.42,39.85 37.19,40.62 ALIM.3 38.71,40.62 40.01,39.32 41.3,39.32 42.52,38.1 v42.52,35.2 | JC2.2 68.63,30.22 67.36,28.96 v66.14,28.96 | v79.17,59.51 78.95,59.29 78.95,58.98 | v63.55,51.66 59.89,51.66 58.14,53.42 58.14,59.44 58.83,60.12 58.83,60.88 59.89,61.95 C7.1 60.66,62.66 60.66,64.01 | v58.06,44.12 57.76,43.89 54.56,43.89 v54.41,43.97 | v51.74,74.14 49.3,76.58 49.3,76.55 JA1.2 | L2.2 30.43,58.13 C30.1
  Bottom 0.152: 21.81,72.08 IC5.24 | 27.82,77.73 C36.1
  Bottom 0.305: C37.1 19.72,73.7 20.12,73.3 20.12,72.54 20.57,72.08 21.81,72.08 26.36,72.08 27.82,73.54 | 27.82,77.73 IC5.34 27.82,73.54 | 32.82,73.51 IC5.44 | 34.82,71.1 IC5.54 39.4,71.1 v39.62,71.32 | v32.92,56.84 32.32,57.44 IC5.83 | 24.12,67.1 IC5.14 | v24.69,64.77 24.69,66.53 24.12,67.1 | 34.82,71.1 34.82,71.51 32.82,73.51 | 32.82,73.51 32.82,71.07 32.61,70.87 30.18,70.87 | 24.12,67.1 25.65,68.63 29.36,68.63 30.18,69.44 30.18,70.87 | 34.82,71.1 34.82,68.2 36.92,66.1 IC5.64 39.49,66.1 C32.1 39.93,66 v39.93,64.24 | 27.82,73.54 30.18,71.18 30.18,70.87 | IC1.16 60.19,27.3 C1.1 | R1.2 40.3,61.57 39.78,61.57 39.31,61.1 IC5.74 37.81,61.11 36.27,61.11 35.97,60.81 v35.97,60.66 35.59,61.04 35.59,64.69 v35.97,65.08
  Bottom 0.356: v51.82,45.57 51.66,45.72 v46.71,45.72
  Bottom 0.406: v37.19,24.84 34.59,27.43 v34.59,32.31 | v42.52,35.2 44.12,36.8 44.65,36.8 46.48,38.63 52.58,38.63 | v58.06,44.12 63.55,49.68 v63.55,51.66 71.4,59.51 v79.17,59.51 | v54.41,43.97 v54.41,46.79 54.41,55.09 57.99,58.67 57.99,59.44 51.74,65.68 v51.74,74.14 | 52.58,38.63 v58.06,44.12 | 59.05,45.11 v58.06,44.12 | 52.58,38.63 54.94,36.27 55.55,36.27 59.11,32.72 59.11,29.31 59.91,28.5 59.97,28.5 | 59.97,28.5 64.01,28.5 64.47,28.96 v66.14,28.96 | C1.1 59.97,27.54 59.97,28.5
+5V  (via drill 0.3 pad 0.61, 0.6)
  Top 0.305: MOT1.6 24,66.75 25.22,65.53 31.24,65.53 31.62,65.91 v31.62,67.36 MOT1.12 | v18.14,56.84 23.01,51.97 31.55,51.97 v33.83,49.68 | MOT2.12 70.42,53.94 68.73,55.47 v72.39,61.87 MOT2.6
  Top 0.406: MOT3.12 37.76,14.94 v37.49,14.94 | v33.53,21.34 MOT3.6 | v29.41,27.74 33.68,31.24 33.68,38.1 v35.36,39.78 | ALIM.4 39.14,43.16 v43.89,38.41 | 43.74,32.84 v43.89,32.84 | v51.89,40.92 51.89,40.77 v54.03,38.63 | GP2.7 53.19,24.54 53.19,25.45 C11.1 | 54.94,30.56 55.78,29.57 55.85,28.35 55.85,27.58 GP2.4 | v61.11,29.41 61.11,30.72 C12.1 62.03,31.17 62.03,30.18 62.41,29.79 62.41,28.7 GP2.1
  Top 0.61: C11.1 51.51,26.82 47.09,29.26 46.56,29.79 v46.56,31.62 | 54.94,30.56 54.7,30.8 C10.1 54.7,30.89 54.56,31.24 49.61,33.98 48.39,35.2 v48.39,35.28 | v44.35,29.41 44.12,29.18 44.12,25.76 44.96,24.31 47.47,22.86 47.62,22.78 C13.1 49.91,21.87 50.9,21.34 51.28,21.34 GP2.10 | v43.89,38.41 v43.89,32.84
  Bottom 0.305: v31.62,67.36 31.62,63.17 29.41,60.96 25.6,60.96 24.38,59.74 23.32,59.74 20.73,57.15 18.14,57.15 17.83,56.84 v18.14,56.84 | v33.83,49.68 33.98,49.53 33.98,47.12 ALIM.4 | v72.39,61.87 72.08,61.87 62.41,52.2 56.46,52.2 55.3,51.03 55.3,43.61 54.59,42.9 53.8,42.9 51.89,41 v51.89,40.92
  Bottom 0.406: v29.41,27.74 30.33,26.36 v33.53,21.34 v37.49,14.94 | v35.36,39.78 35.36,41.45 36.88,42.98 37.77,42.98 ALIM.4 | 51.89,40.69 v51.89,40.92 50.83,39.85 45.34,39.85 v43.89,38.41 | v54.03,38.63 54.18,38.63 59.89,32.92 59.89,30.94 60.35,30.48 R24.2 61.11,30.39 v61.11,29.41
  Bottom 0.61: v48.39,35.28 46.56,33.45 v46.56,31.62 v44.35,29.41 43.89,29.87 v43.89,32.84
+12V  (via drill 0.6)
  Top 0.406: v39.78,31.09 38.56,31.09 37.26,32.38 37.26,33.45 37.95,34.14 ALIM.1 | v60.81,34.21 59.13,34.21 55.17,38.18 | 55.17,38.18 55.17,39.78 59.05,43.66 v59.05,46.56 | v53.11,36.88 53.87,36.88 55.17,38.18 | v58.52,51.28 54.1,55.7 54.1,58.14 49.68,62.56 49.68,63.4 48.23,64.85 JA1.16
  Bottom 0.406: v60.81,34.21 61.02,34 R25.2 | v39.78,31.09 46.71,38.02 51.97,38.02 v53.11,36.88 | v58.52,51.28 58.52,47.09 v59.05,46.56
/CS_ADXRS453_3V3  (via drill 0.6)
  Top 0.305: IC2.4 58.12,63.3 57.61,62.79 57.61,61.04 56.3,59.73 v55.84,59.73
  Bottom 0.305: IC5.75 38.92,60.6 39.55,59.97 40.22,59.97 R1.1 40.98,59.73 41.76,60.5 41.76,61.49 43.89,63.63 51.95,63.63 v55.84,59.73
/CS_MOT0_3V3  (via drill 0.3 pad 0.6)
  Top 0.152: MOT1.16 37.34,69.47 37.34,76.43 35.59,78.18 30.79,78.18 30.18,77.57 v30.18,76.66
  Bottom 0.152: IC5.39 30.32,76.42 30.18,76.56 v30.18,76.66
/CS_MOT1_3V3  (via drill 0.3 pad 0.61)
  Top 0.152: MOT2.16 67.36,49.54 66.6,50.75 65.99,51.05 65.08,51.05 64.16,50.14 58.06,50.14 57.3,50.9 v56.24,50.9
  Bottom 0.152: IC5.22 17.45,71.1 11.73,65.38 11.73,60.88 14.33,58.29 14.33,57.91 14.63,57.61 14.63,49.07 18.14,45.57 18.14,43.28 18.75,42.37 19.44,42.37 JB1.3 21.18,40.23 21.18,38.1 22.71,35.51 23.32,35.51 25.6,33.22 38.86,33.22 43.28,37.64 44.27,37.64 46.02,39.4 51.44,39.4 54.48,42.44 55.17,42.44 57,44.27 57,48.77 56.24,49.53 v56.24,50.9
/CS_MOT2_3V3  (via drill 0.3, 0.3 pad 0.61)
  Top 0.152: MOT3.16 39.94,10.67 v39.62,10.36 | v23.01,34.9 24.23,35.81 v24.69,36.12
  Bottom 0.152: IC5.21 17.41,70.6 12.04,65.23 12.04,61.04 14.63,58.45 14.63,58.06 14.94,57.76 14.94,49.23 19.17,44.99 JB1.4 19.86,42.67 20.57,42.67 v24.69,36.12 | v39.62,10.36 37.03,10.52 35.97,11.43 23.01,33.98 v23.01,34.9
/RESET_3V3  (via drill 0.3 pad 0.61)
  Top 0.152: v28.96,56.31 27.96,55.32 23.32,55.32 22.8,55.93 R19.2 22.03,56.76 19.05,59.74 17.22,62.64 17.22,63.55 PDI_UC.5
  Bottom 0.152: IC5.90 28.82,56.45 v28.96,56.31
BRAKE_MOT0_3V3  (via drill 0.3 pad 0.6)
  Top 0.152: MOT1.4 21.49,74.45 21.49,76.66 21.79,76.96 28.96,76.96 30.48,78.49 35.74,78.49 40.01,74.22 40.01,73.46 41.45,72.01 41.45,68.81 v41.53,68.66
  Bottom 0.152: IC5.59 41.4,68.6 v41.53,68.66 41.76,68.66 44.58,65.84 45.99,65.84 JA1.14
BRAKE_MOT1_3V3  (via drill 0.3, 0.3 pad 0.61)
  Top 0.152: 76.14,62.73 MOT2.4 76.56,62.18 v76.73,62.18 | v74.98,45.26 71.32,45.26 70.87,45.57 64.77,49.23 57.3,49.23 56.54,48.46 53.26,48.46 51.89,49.84 51.89,51.74 52.2,52.05 52.2,58.75 47.7,63.25 45.34,63.25 45,63.59 JA1.15
  Bottom 0.152: v74.98,45.26 74.98,53.65 80.16,58.83 80.16,60.2 78.64,61.72 77.19,61.72 v76.73,62.18 | JA1.15 41.75,68.1 IC5.60
BRAKE_MOT2_3V3  (via drill 0.3)
  Top 0.152: MOT3.4 v33.07,24.08 | v31.39,32.61 31.39,35.97 v32.92,37.49 | JB1.12 26.37,47.09 27.28,47.09 28.19,45.87 28.19,44.5 v27.28,43.59
  Bottom 0.152: IC5.1 21.82,60.22 19.36,57.76 17.83,57.76 17.37,57.3 17.37,50.44 19.05,48.77 24.7,48.77 JB1.12 | v33.07,24.08 31.39,27.13 v31.39,32.61 | v32.92,37.49 32.92,38.25 29.41,43.59 v27.28,43.59
DIRECTION_MOT0_3V3
  Top 0.152: MOT1.3 20.19,77.04 20.42,77.27 28.8,77.27 30.33,78.79 35.97,78.79 38.48,76.28 38.86,76.28 39.47,76.89 41.76,76.89 42.98,75.67 42.98,70.87 43.43,70.41 JA1.11
  Bottom 0.152: IC5.56 42.14,70.1 43.4,68.85 JA1.11
DIRECTION_MOT1_3V3  (via drill 0.3 pad 0.61)
  Top 0.152: v86.72,64.01 86.72,62.64 84.58,60.5 82.32,60.5 MOT2.3
  Bottom 0.152: IC5.57 41.96,69.6 43.66,67.89 46.05,67.89 JA1.12 49,70.84 49,72.85 51.89,75.74 66.14,75.74 68.89,78.49 72.24,78.49 v86.72,64.01
DIRECTION_MOT2_3V3  (via drill 0.3 pad 0.61)
  Top 0.152: MOT3.3 v38.1,28.65 | v40.69,36.42 40.69,35.66 37.95,32.92 v37.95,32.69 | v53.65,49.15 53.11,49.15 52.2,50.06 52.2,51.51 52.58,51.89 52.58,58.83 47.85,63.55 46.63,63.55 46.02,64.16 46.02,65.82 JA1.13
  Bottom 0.152: v53.65,49.15 53.65,43.74 50.37,40.46 44.96,40.46 40.92,36.42 v40.69,36.42 | v37.95,32.69 37.95,28.8 v38.1,28.65 | IC5.58 40.91,69.1 41.07,69.27 41.83,69.27 44.25,66.85 JA1.13
ENCODER_A_MOT0_3V3  (via drill 0.3 pad 0.61)
  Top 0.305: MOT1.8 26.26,69.42 v26.29,70.18
  Bottom 0.152: JB1.9 24.74,45.26 24.08,45.26 21.49,47.85 18.59,47.85 16.46,49.99 16.46,58.52 16.15,58.83 16.15,59.21 13.56,61.8 13.56,64.47 17.2,68.1 IC5.16 23.45,68.1 25.53,70.18 v26.29,70.18
ENCODER_A_MOT1_3V3  (via drill 0.3, 0.3 pad 0.61)
  Top 0.152: 72.08,59.59 72.21,59.59 MOT2.8 73.69,58.11 v73.69,57.76 | v73.61,44.5 73,43.89 72.08,43.89 64.47,48.62 57.61,48.62 53.26,44.27 53.26,42.29 52.88,41.91 v50.06,41.91
  Bottom 0.152: IC5.18 17.28,69.1 12.95,64.77 12.95,61.49 15.54,58.9 15.54,58.52 15.85,58.22 15.85,49.68 18.29,47.24 19.51,47.24 22.4,44.35 22.92,44.35 JB1.7 23.63,43.57 24.23,42.98 27.58,42.82 30.02,39.01 30.63,39.01 35.2,34.44 39.47,34.44 40.08,35.05 40.08,36.88 40.39,37.19 40.39,37.95 41.3,38.86 41.68,38.86 44.2,41.38 49.68,41.38 50.06,41.76 v50.06,41.91 | v73.61,44.5 73.61,57.68 v73.69,57.76
ENCODER_A_MOT2_3V3  (via drill 0.3)
  Top 0.152: v32,33.91 v32,31.7 | v36.04,19.81 35.55,19.66 MOT3.8
  Bottom 0.152: IC5.20 17.37,70.1 12.34,65.08 12.34,61.19 14.94,58.6 14.94,58.22 15.24,57.91 15.24,49.38 19.66,44.96 19.66,44.35 20.42,43.43 21.1,43.43 JB1.5 23.77,40.77 24.23,40.77 26.44,36.96 29.49,33.91 v32,33.91 | v32,31.7 32,27.36 v36.04,19.81
ENCODER_B_MOT0_3V3  (via drill 0.3 pad 0.6)
  Top 0.152: MOT1.10 28.96,68.96 v28.96,69.52
  Bottom 0.152: JB1.10 22.57,48.16 18.75,48.16 16.76,50.14 16.76,58.67 16.46,58.98 16.46,59.36 13.87,61.95 13.87,64.31 17.15,67.6 IC5.15 23.86,67.6 25.78,69.52 v28.96,69.52
ENCODER_B_MOT1_3V3  (via drill 0.3, 0.3 pad 0.61)
  Top 0.152: v72.69,44.5 71.93,44.5 71.63,44.65 64.62,48.92 57.45,48.92 52.96,44.42 52.96,42.75 52.65,42.44 49.76,42.44 v49.3,41.99 | v72.69,55.63 MOT2.10
  Bottom 0.152: IC5.17 17.24,68.6 13.26,64.62 13.26,61.65 15.85,59.05 15.85,58.67 16.15,58.37 16.15,49.84 18.44,47.55 20.45,47.55 JB1.8 24.08,44.65 25.45,43.28 26.06,43.28 27.28,44.5 31.24,44.5 31.39,44.35 32.92,41.91 33.38,41.45 33.38,40.08 36.58,36.88 39.62,36.88 40.08,37.34 40.08,38.1 41.15,39.17 41.53,39.17 44.35,41.99 v49.3,41.99 | v72.69,44.5 v72.69,55.63
ENCODER_B_MOT2_3V3  (via drill 0.3)
  Top 0.152: v32.84,33.98 v32.84,32 | v37.72,17.98 37.11,17.75 MOT3.10
  Bottom 0.152: IC5.19 17.33,69.6 12.65,64.92 12.65,61.34 15.24,58.75 15.24,58.37 15.54,58.06 15.54,49.53 18.14,46.94 18.33,46.94 JB1.6 21.53,43.74 22.25,43.74 23.77,41.68 26.06,41.68 28.65,37.03 29.79,37.03 v32.84,33.98 | v32.84,32 32.84,27.2 v37.72,17.98
GND  (via drill 0.3, 0.3 pad 0.6, 0.3 pad 0.61, 0.6)
  Top 0.152: MOT1.1 17.65,67.49 15.16,65 15.16,64.06 PDI_UC.6 | v23.62,60.5 21.79,62.18 C28.2 | LED4.C LED3.C LED2.C LED1.C | 35.3,29.7 28.19,25.6 27.04,25.6 26.6,26.04 25.68,27.69 | 35.3,29.7 MOT3.1 | LED1.C 25.68,27.69 | MOT1.1 16.92,73.69 v16.92,71.93 | v26.36,56.24 C29.2 | v25.28,72.77 25.28,73.76 MOT1.7 MOT1.9 27.89,74.35 v27.89,72.39 | MOT2.1 82.15,63.24 82.14,63.25 | H2.B3,3 12.2,75.74 17.37,75.74 17.53,75.59 17.53,74.55 MOT1.1 | LED1.C 25.61,27.77 25.68,27.69 | 36.88,31.09 37.49,30.48 | v39.78,23.77 MOT3.7 | 35.3,29.7 v36.12,30.33 | v47.95,30.05 47.95,29.98 48,29.93
  Top 0.305: MOT1.1 17.73,66.02 18.9,64.85 21.63,64.85 C38.2 C28.2 21.79,62.09 21.79,60.96 25.54,57.21 C29.2 | v32.16,60.96 C30.2 33.96,59.83 C31.2 34.29,59.52 v34.29,60.91 | v39.78,67.51 39.78,68.57 C33.2 40.02,68.89 40.54,68.89 41,69.34 41,71.02 v39.93,72.08 40.08,72.08 | MOT1.11 30.79,73.99 v30.79,72.01 | MOT1.11 30.79,74.85 30.79,77.42 31.17,77.8 35.36,77.8 36.58,76.58 36.58,74.07 36.73,73.91 v36.73,73.46 | 27.89,74.35 27.96,74.42 MOT1.11 | MOT2.11 MOT2.9 MOT2.7 | MOT3.1 v36.12,30.33 36.65,30.86 36.88,31.09 | IC2.3 56.84,61.77 C8.2 | C7.2 61.92,62.89 IC2.7 61.92,67.36 | IC2.10 61.92,73.44 C9.2 61.94,78.02 62.1,78.18 64.62,78.18 65.46,77.34 65.46,76.73 v65.38,76.66 | IC2.10 IC2.11 IC2.12 | IC2.10 61.92,67.36 | IC2.3 56.84,66.29 57.76,67.21 61.77,67.21 61.92,67.36 | IC2.2 IC2.3
  Top 0.356: UART_I2C.6 v45.41,49.84 | v50.44,49.84 50.49,49.89 UART_I2C.2
  Top 0.406: MOT3.7 MOT3.9 MOT3.11 arc-56 44.2,19.51 45.41,19.13 v46.56,17.45 | ALIM.2 35.66,35.79 35.66,31.85 36.65,30.86 | MOT2.7 79.07,56.64 v79.7,56.01 | v83.52,62.56 MOT2.1 82.75,65.37 85.16,67.79 H3.B3,3 69.62,72.41 v65.38,76.66 65.14,76.66 | R3.1 49.45,14.63 | C2.2 58.12,76.53 IC2.13 IC2.12
  Top 0.61: 51.74,23.93 C13.2 48.84,25.15 R4.1 47.55,24.61 47.09,24.46 45.34,25.45 v45.11,26.36 | 55.24,33.6 C10.2 54.63,33.76 R5.1 53.11,33.68 52.05,33.68 50.22,34.67 49.68,35.2 v49.68,35.28 | C11.2 R2.1 50.06,28.96 49.38,28.96 48.08,29.72 48,29.93 v47.95,30.05 47.78,30.48 v47.78,32.08
  Bottom 0.152: 27.32,56.39 27.32,55.21 26.98,54.86 19.96,54.86 19.51,54.41 19.51,52.43 19.96,51.97 20.49,51.97 C35.2 | 27.32,56.39 IC5.93 | v16.92,71.93 16.98,72 C37.2 19.75,72 20.12,71.63 21.79,71.63 IC5.23 27.1,71.6 v27.89,72.39 | PDI_UC.6 15.03,64.86 17.37,67.21 19.96,67.21 20.57,66.6 IC5.13 | C36.2 26.21,77.64 26.21,76.96 27.32,75.86 IC5.33 27.32,73.65 26.44,72.77 v25.28,72.77 | IC5.63 38.86,66.6 v39.78,67.51 40.84,67.51 41.69,66.66 C32.2 | IC5.3 21.85,61.57 23.01,61.57 23.62,60.96 v23.62,60.5 | v65.38,76.66 65.34,76.78 | v26.36,56.24 26.52,56.39 27.32,56.39 | v36.12,30.33 v39.78,23.77 | 40.16,40.62 40.22,40.68 | 48.31,30.1 48,30.1 v47.95,30.05
  Bottom 0.305: v32.16,60.96 31.82,60.62 31.82,60.05 | IC5.93 27.32,59.63 27.74,60.05 31.82,60.05 | 31.82,60.05 IC5.84 | v39.93,72.08 39.47,72.08 38.98,71.6 IC5.53 36.76,71.6 36.58,71.78 36.58,73.3 v36.73,73.46 | IC5.43 32.32,73.47 30.79,71.93 v30.79,72.01 | v34.29,60.91 34.98,61.6 | v65.38,76.66 64.47,77.57 50.29,77.57 v49.99,77.88 49.93,77.82 46.02,77.82 JA1.1 44.9,78.94 | C5.2 48.05,19.55 49,20.5 49,21.13 IC1.8 48.97,22.84 49.53,23.39 55.32,23.39 57.34,25.41 | C4.2 61,21.38 61.65,22.02 61.65,24.92 61.19,25.38 60.24,25.38 C1.2 57.34,25.41 | 57.34,25.41 56.62,26.14 56.62,27.28 IC1.15 | R23.2 46.8,28.59 48.31,30.1 49.06,30.1 R21.2
  Bottom 0.356: v45.41,49.84 v50.44,49.84
  Bottom 0.406: C35.2 20.73,52.03 C34.2 37.95,51.88 37.95,51.21 36.42,49.68 v36.42,48.69 36.42,47.24 40.16,43.51 40.16,40.62 40.16,40.23 39.55,39.62 39.55,38.86 38.76,38.08 ALIM.2 | v79.7,56.01 v83.52,62.56 | C5.2 47.59,18.09 v46.56,17.45 46.63,14.25 H1.B3,3
  Bottom 0.61: v49.68,35.28 49.68,33.98 v47.78,32.08 | v45.11,26.36 44.96,26.21 44.96,23.09 46.89,21.16 IC1.8
  other vias: 28.8,53.04 33.91,45.87 59.44,35.28 64.77,39.78 33.99,51.36 16.31,45.87 20.57,40.08 17.53,61.11 21.95,51.36 66.83,27.66 45.26,34.59 47.47,10.74 56.08,11.05 37.11,55.85 41.76,54.1 38.79,47.17 42.44,44.27 52.81,68.12 54.86,57.61 56.46,54.48 69.27,63.4 69.04,67.36 53.87,35.97 53.64,53.95 55.4,53.04
  pour Top: 40.54,0 0,69.95 5.79,80.01 86.72,80.01 92.51,70.1 51.44,-1.07 40.46,-0.38
  pour Bottom: 39.85,-0.61 0,70.1 5.79,79.86 86.72,80.01 92.35,70.1 52.35,-0.53 50.14,-1.14
GP2_0_0-1V  (via drill 0.3)
  Top 0.152: R5.2 52.18,34.9 51.36,34.9 50.14,36.12 48.54,36.12 40.54,44.12 40.54,55.32 38.63,57.23 38.63,60.27 34.67,64.24 34.14,64.77 32,64.77 v27.74,64.77
  Top 0.305: R9.1 58.37,33.29 58.37,34.06 57.15,35.28 52.64,35.28 52.27,34.98 R5.2
  Bottom 0.152: IC5.8 27.07,64.1 v27.74,64.77
GP2_1_0-1V  (via drill 0.3)
  Top 0.152: R6.1 46.94,35.58 46.94,37.26 40.23,43.97 40.23,55.17 38.33,57.07 38.33,60.12 34.9,63.55 34.44,64.01 32.54,64.01 v28.42,64.01
  Top 0.305: R2.2 R6.1
  Bottom 0.152: IC5.7 28.01,63.6 v28.42,64.01
GP2_2_0-1V  (via drill 0.3)
  Top 0.152: R8.1 45.8,29.64 45.8,32.61 46.56,33.38 46.56,37.19 39.93,43.81 39.93,55.02 38.02,56.92 38.02,59.97 34.9,63.09 34.52,63.48 29.87,63.48 v29.11,63.48
  Top 0.305: R8.1 R4.2
  Bottom 0.152: IC5.6 28.73,63.1 v29.11,63.48
GP2_3_0-1V  (via drill 0.3)
  Top 0.152: v29.64,62.87 34.67,62.87 37.72,59.82 37.72,56.77 39.62,54.86 39.62,43.66 46.25,37.03 46.25,33.6 45.49,32.84 45.49,31.55 43.51,29.57 43.51,25.6 44.5,23.85 46.71,19.51 47.85,18.9 R7.1
  Top 0.305: R3.2 49.91,16.99 49.91,17.53 49.07,18.52 R7.1
  Bottom 0.152: IC5.5 29.38,62.6 v29.64,62.87
MISO_ADXRS453_3V3  (via drill 0.3)
  Top 0.152: v50.83,71.86 44.42,71.86 43.66,72.62 43.66,76.12 v43.36,76.5
  Top 0.305: IC2.5 59.38,63.73 58.22,62.56 58.22,60.5 56.62,58.9 54.41,58.9 50.83,62.48 v50.83,68.43
  Bottom 0.152: IC5.31 26.32,75.86 25.91,76.28 25.6,76.28 24.46,77.42 24.46,78.72 24.77,79.02 40.84,79.02 v43.36,76.5
  Bottom 0.305: v50.83,68.43 v50.83,71.86
MISO_MOT_3V3  (via drill 0.3 pad 0.6, 0.3 pad 0.61)
  Top 0.152: v32.46,76.35 32.46,74.83 32.92,74.45 MOT1.13 32.89,66.06 33.81,65.15 34.21,65.15 39.09,60.27 39.09,58.06 v40.23,56.92 | MOT2.13 75.33,49.84 75.59,49.84 74.91,50.52 72.16,50.52 70.26,47.4 70.1,47.24 69.34,47.24 65.08,49.84 57.91,49.84 57.3,50.44 56.69,50.44 56.54,50.29 53.42,50.29 v53.11,50.6 | MOT3.13 44.44,17.83 v44.65,17.83 | v39.62,32.61 39.62,33.53 41.6,35.51 41.6,38.02 v41.45,38.18
  Bottom 0.152: 31.32,75.97 IC5.41 | v32.46,76.35 31.7,76.35 31.32,75.97 | 31.32,75.97 | v44.65,17.83 44.81,17.98 44.81,19.96 38.71,30.79 38.71,31.7 v39.62,32.61 | v41.45,38.18 41.53,38.18 44.42,41.07 50.06,41.07 53.03,44.04 53.03,48.31 52.58,48.77 52.58,50.06 v53.11,50.6 52.65,51.05 46.56,51.05 40.69,56.92 v40.23,56.92
MOSI_ADXRS453_3V3  (via drill 0.3)
  Top 0.152: v23.55,78.41 23.55,78.49 24.46,79.4 36.73,79.4 37.64,78.49 42.22,78.49 43.97,76.73 43.97,74.37 44.5,73.84 48.08,73.84 49.38,72.54 52.5,72.54 53.49,73.53 53.49,75.51 53.95,75.97 54.86,75.97 55.47,75.36 55.47,74.67 IC2.15
  Bottom 0.152: IC5.30 25.82,75.6 23.55,77.88 v23.55,78.41
MOSI_MOT_3V3  (via drill 0.3 pad 0.6, 0.3 pad 0.61)
  Top 0.152: 70.33,51.05 MOT2.14 69.27,52.12 67.06,52.12 66.29,51.36 64.92,51.36 64.01,50.44 58.22,50.44 57.15,51.51 v53.65,51.51 | MOT3.14 39.17,13.41 v39.78,13.41 | v38.71,32.61 38.71,33.07 41.3,35.66 41.3,37.11 v41,37.41 | v31.39,76.81 31.55,76.96 33.22,76.96 34.16,76.02 MOT1.14 34.16,65.68 34.31,65.53 34.98,64.85 39.55,60.27 39.55,58.45 40.21,57.78 v40.23,57.78
  Bottom 0.152: v39.78,13.41 39.78,14.02 44.5,18.75 44.5,19.81 38.34,30.66 38.34,32.25 v38.71,32.61 | v41,37.41 41.45,37.41 44.81,40.77 50.22,40.77 53.34,43.89 53.34,48.46 52.96,48.84 52.96,49.61 53.65,50.29 v53.65,51.51 46.63,51.51 40.36,57.78 v40.23,57.78 | IC5.40 30.82,76.23 v31.39,76.81
N$1  (via drill 0.6)
  Top 0.406: v66.14,30.48 66.9,31.16 JC2.4
  Bottom 0.406: R24.1 v66.14,30.48
N$2
  Bottom 0.305: IC1.1 57.86,20.47 58.52,19.81 58.52,18.63 C3.1
N$3
  Bottom 0.305: IC1.4 54.05,18.68 C6.1
N$4
  Top 0.152: LED4.A R18_Q3.2
N$5
  Bottom 0.305: IC1.3 55.32,19.93 C3.2
N$6  (via drill 0.3 pad 0.61)
  Top 0.152: R18_Q3.1 28.31,35.93 34.67,42.29 34.67,52.88 32.92,54.56 30.86,54.56 v30.33,55.09
  Bottom 0.152: IC5.88 29.82,57.66 30.33,57.15 v30.33,55.09
N$7
  Bottom 0.305: IC5.91 28.32,55.35 30,53.67 Q1.2 34.15,53.73 C34.1
N$8
  Bottom 0.152: 24.34,53.58 Q1.1
  Bottom 0.305: IC5.92 27.82,54.19 27.58,53.95 24.71,53.95 Q1.1 | C35.1 24.34,53.58
N$9  (via drill 0.3 pad 0.61)
  Top 0.152: R17_Q2.1 28.47,34.1 29.34,34.82 29.34,36.5 34.98,42.14 34.98,53.03 33.07,54.86 32.16,54.86 v31.09,55.93
  Bottom 0.152: IC5.87 30.32,57.62 30.63,57.3 30.63,56.39 v31.09,55.93
N$10  (via drill 0.3 pad 0.61)
  Top 0.152: R16_Q1.1 29.64,33.14 29.64,36.35 35.28,41.99 35.28,53.19 33.22,55.17 32.77,55.17 v32,55.93
  Bottom 0.152: IC5.86 30.82,57.57 30.94,57.45 30.94,57 v32,55.93
N$11  (via drill 0.3 pad 0.61)
  Top 0.152: R15_Q0.1 30.63,30.63 30.63,32.16 29.95,33.3 29.95,36.2 35.59,41.83 35.59,53.34 v32.92,55.93
  Bottom 0.152: IC5.85 31.32,57.53 v32.92,55.93
N$12
  Top 0.152: LED1.A 28.95,29.58 | 28.95,29.58 R15_Q0.2 28.96,29.6 28.95,29.58
N$13
  Top 0.152: R16_Q1.2 LED2.A
N$14
  Top 0.152: LED3.A R17_Q2.2
N$15
  Bottom 0.406: R25.1 63.86,32.61 JC2.6
N$16
  Bottom 0.305: IC1.5 52.78,18.98 C6.2
N$17
  Bottom 0.305: IC1.2 56.59,22.45 57.53,23.39 60.01,23.39 C4.1
N$18
  Top 0.305: L1.2 65.34,62.22 63.32,64.24 63.32,64.77 IC2.8 65.73,65.03 D1.A
N$19
  Top 0.406: C2.1 56.84,76.32 IC2.14
N$20
  Bottom 0.305: IC1.6 51.51,20.34 50.37,19.2 50.37,18.94 C5.1
N$21
  Top 0.305: IC2.1 54.3,63.02 C8.1
N$22
  Top 0.305: R8.2 52.58,24.77 52.58,24 53.49,23.09
  Top 0.406: 53.49,23.09 GP2.8
N$23
  Top 0.305: C9.1 64.85,75.91 64.85,69.72 D1.C
  Top 0.406: IC2.9 63.17,74.59 63.17,75.89 63.32,76.05 63.32,76.8 C9.1
N$24
  Top 0.406: GP2.2 60.05,31.7 R9.2
N$25  (via drill 0.3 pad 0.6)
  Top 0.152: v26.36,60.2 26.36,58.98 C29.1 | C28.1 23.47,62.12 23.71,61.87 v24.69,61.87
  Top 0.305: 23.47,62.12 23.47,61.57 23.62,61.42 23.93,61.42 26.36,58.98
  Top 0.406: C29.1 27.94,58.91 L2.1
  Bottom 0.152: v26.36,60.2 26.82,59.74 IC5.94 | v24.69,61.87 24.46,62.1 IC5.4
N$26  (via drill 0.3)
  other vias: 52.35,16.15
N$36
  Top 0.305: R7.2 48.69,20.57 49.84,20.04 50.83,20.06 GP2.11
N$37
  Top 0.305: R6.2 55.09,29.41 55.17,28.65 54.48,27.43 54.48,26.75 GP2.5
PA0
  Bottom 0.152: IC5.95 26.32,57.26 24.23,55.17 19.81,55.17 19.2,54.56 19.2,51.36 19.96,50.6 31.24,50.6 32.99,48.84 32.99,45.64 33.56,45.08 JB2.15
PA1
  Bottom 0.152: IC5.96 25.82,57.21 24.08,55.47 19.66,55.47 18.9,54.71 18.9,51.21 19.81,50.29 31.09,50.29 32.56,48.82 JB2.16
PA2
  Bottom 0.152: IC5.97 25.32,57.17 23.93,55.78 19.51,55.78 18.59,54.86 18.59,51.05 19.66,49.99 28.94,49.99 JB1.16
PA3
  Bottom 0.152: IC5.98 24.82,57.13 23.77,56.08 19.36,56.08 18.29,55.02 18.29,50.9 19.51,49.68 27.89,49.68 29.26,48.31 29.89,48.31 JB1.15
PA4
  Bottom 0.152: IC5.99 24.32,57.09 23.62,56.39 19.2,56.39 17.98,55.17 17.98,50.75 19.36,49.38 25.91,49.38 26.82,49.38 JB1.14
PA5
  Bottom 0.152: IC5.100 23.82,57.1 23.41,56.69 19.05,56.69 17.68,55.32 17.68,50.6 19.2,49.07 25.76,49.07 27.43,47.4 28.07,47.4 JB1.13
PA7
  Bottom 0.152: IC5.2 20.94,61.1 20.8,60.96 20.8,59.89 18.97,58.06 17.68,58.06 17.07,57.45 17.07,50.29 18.9,48.46 23.62,48.46 25.76,46.33 26.4,46.33 JB1.11
PD0  (via drill 0.3 pad 0.6)
  Top 0.152: v14.02,54.41 19.36,49.07 24.23,49.07 26.52,51.36 31.24,51.36 32.61,49.99 32.61,45.87 33.68,44.81 33.68,44.04 32.26,42.78 JB2.13
  Bottom 0.152: v14.02,54.41 14.02,58.14 11.43,60.73 11.43,65.53 16,70.1 16,72.54 18.29,74.83 20.27,74.83 21.82,73.28 IC5.25
PD1  (via drill 0.3 pad 0.6)
  Top 0.152: v14.02,53.49 14.48,53.49 19.2,48.77 24.38,48.77 26.67,51.05 31.09,51.05 32.31,49.84 32.31,45.57 30.83,44.09 JB2.14
  Bottom 0.152: v14.02,53.49 13.41,54.1 13.41,54.71 13.72,55.02 13.72,57.99 11.12,60.58 11.12,65.68 15.7,70.26 15.7,72.69 18.14,75.13 20.42,75.13 20.96,74.6 IC5.26
PD2  (via drill 0.3 pad 0.6)
  Top 0.152: v13.11,53.65 13.87,52.88 14.63,52.88 19.05,48.46 24.54,48.46 26.82,50.75 30.94,50.75 32,49.68 32,46.48 29.72,44.2 29.72,43.13 30.18,42.52 30.18,40.71 JB2.11
  Bottom 0.152: IC5.27 24.32,75.5 23.93,75.89 18.44,75.89 15.39,72.85 15.39,70.41 10.82,65.84 10.82,60.43 13.41,57.84 13.41,55.17 13.11,54.86 v13.11,53.65
PD3  (via drill 0.3 pad 0.6)
  Top 0.152: v13.26,52.73 13.41,52.58 14.33,52.58 18.75,48.16 24.84,48.16 26.98,50.44 30.79,50.44 31.7,49.53 31.7,46.63 29.1,44.03 JB2.12
  Bottom 0.152: IC5.28 24.82,75.46 24.08,76.2 18.29,76.2 15.09,73 15.09,70.56 10.52,65.99 10.52,60.27 13.11,57.68 13.11,55.32 12.5,54.71 12.5,53.49 v13.26,52.73
PDI_DATA_3V3  (via drill 0.3 pad 0.61)
  Top 0.152: v29.64,56.84 29.49,57 28.5,57 27.13,55.63 24.93,55.63 22.65,57.91 22.33,57.91 PDI_UC.1
  Bottom 0.152: IC5.89 29.32,57.17 v29.64,56.84
PF3
  Bottom 0.152: IC5.48 34.82,75.51 35.36,76.05 37.72,76.05 38.94,74.83 39.93,74.83 40.84,73.91 44.07,73.91 JA1.5
PF4
  Bottom 0.152: IC5.49 35.32,75.48 35.59,75.74 37.57,75.74 38.79,74.52 39.78,74.52 40.69,73.61 44.27,73.61 44.5,73.84 45.99,73.84 JA1.6
PF5
  Bottom 0.152: IC5.50 38.25,74.6 38.71,74.14 39.7,74.14 40.62,73.23 44.62,73.23 JA1.7
PF6
  Bottom 0.152: IC5.51 38.92,72.6 39.24,72.92 40.39,72.92 40.77,72.54 43.81,72.54 44.5,71.86 46.01,71.86 JA1.8
PF7
  Bottom 0.152: IC5.52 38.88,72.1 39.4,72.62 40.23,72.62 40.62,72.24 43.61,72.24 JA1.9
PH0
  Bottom 0.152: IC5.55 42.71,70.6 43.51,69.8 45.95,69.8 JA1.10
PWM_MOT0_3V3  (via drill 0.3 pad 0.6, 0.3 pad 0.61)
  Top 0.152: v19.36,65.99 18.92,66.42 MOT1.2 18.92,77.14 19.36,77.57 28.65,77.57 30.18,79.1 36.5,79.1 v38.71,76.89 | v16.46,63.09 14.86,62.03 12.5,59.66 12.5,50.14 16,44.65 19.2,44.65 19.81,44.2 21.49,41.45 22.12,41.15 JB2.6
  Bottom 0.152: IC5.45 33.32,75.53 34.06,76.28 34.21,76.28 35.13,77.19 38.41,77.19 v38.71,76.89 | v19.36,65.99 19.36,65.53 18.36,64.31 v16.46,63.09
PWM_MOT1_3V3  (via drill 0.3 pad 0.61)
  Top 0.152: JA1.3 45.95,75.89 47.7,75.89 50.75,72.85 52.27,72.85 52.96,73.53 52.96,78.33 53.57,78.94 69.65,78.94 v70.71,77.88 | v75.89,69.19 75.74,69.04 75.74,66.29 77.1,64.93 MOT2.2
  Bottom 0.152: IC5.46 33.83,74.61 33.83,75.44 35.05,76.66 38.02,76.66 39.24,75.44 40.23,75.44 41.15,74.52 42.68,74.52 JA1.3 | v70.71,77.88 72.39,77.88 75.89,74.37 v75.89,69.19
PWM_MOT2_3V3  (via drill 0.3, 0.3 pad 0.61)
  Top 0.152: v13.72,74.98 13.72,61.34 12.19,59.82 12.19,49.99 15.85,44.2 17.83,43.43 22.71,35.51 v21.79,34.14 | v27.74,23.93 MOT3.2 | v42.9,78.72 43.81,77.8 46.05,77.8 JA1.4
  Bottom 0.152: IC5.47 34.32,75.47 35.2,76.35 37.87,76.35 39.09,75.13 40.08,75.13 41,74.22 42.9,74.22 44.58,75.89 46.05,75.89 JA1.4 | v13.72,74.98 14.78,74.98 19.28,79.48 42.14,79.48 v42.9,78.72 | v27.74,23.93 v21.79,34.14
RX_3V3  (via drill 0.3)
  Top 0.152: v40.31,76.35 40.31,73.61 41.76,72.16 41.76,70.26 42.22,69.8 42.22,61.95 40.84,60.58 40.84,44.27 48.31,36.8 48.92,36.8 v49.45,37.34
  Bottom 0.152: IC5.37 29.26,74.66 29.26,75.67 29.11,75.82 29.11,77.11 29.79,77.8 39.09,77.8 40.31,76.58 v40.31,76.35 | R21.1 50.84,35.95 v49.45,37.34
  Bottom 0.305: R21.1 52.64,30.18 R20.2 52.78,30.04 IC1.12
RX_232  (via drill 0.3)
  Top 0.152: UART_I2C.4 47.95,41.96 50.67,39.24 v50.67,37.34
  Bottom 0.152: R20.1 54.42,33.44 50.67,37.19 v50.67,37.34
  Bottom 0.305: R20.1 54.42,29.12 54.03,28.73 54.03,27.33 IC1.13
SCK_ADXRS453_3V3  (via drill 0.3)
  Top 0.152: v41.53,77.57 43.28,75.82 43.28,71.17 44.65,69.8 51.66,69.8 54.3,72.44 IC2.16
  Bottom 0.152: IC5.32 26.82,75.82 25.98,76.66 25.68,76.66 24.84,77.5 24.84,78.56 24.99,78.72 40.39,78.72 v41.53,77.57
SCK_MOT_3V3  (via drill 0.3 pad 0.6, 0.3 pad 0.61)
  Top 0.152: v34.06,76.89 35.2,76.89 35.43,76.66 MOT1.15 35.43,64.85 40.23,60.05 v40.23,58.6 | MOT2.15 74.3,47.4 74.83,47.4 74.37,46.33 74.07,46.02 70.71,46.02 64.92,49.53 57.45,49.53 v57,49.84 56.84,49.99 52.88,49.99 52.5,50.37 52.5,51.36 53.03,51.89 53.03,57.84 v53.19,57.99 | MOT3.15 44.9,14.57 v45.57,15.24
  Bottom 0.152: IC5.42 31.82,75.56 32.08,75.82 32.99,75.82 v34.06,76.89 | v45.57,15.24 45.38,15.43 45.38,19.58 39.02,30.9 39.02,31.55 39.32,31.85 39.62,31.85 40.39,32.61 40.39,34.21 43.51,37.34 44.42,37.34 46.18,39.09 51.66,39.09 54.71,42.14 55.32,42.14 57.3,44.12 57.3,49.53 v57,49.84 | v40.23,58.6 41.15,58.9 42.22,59.97 42.22,61.27 44.04,63.09 48.08,63.09 v53.19,57.99
SCL_3V3  (via drill 0.3)
  Top 0.152: UART_I2C.7 44.2,45.09 44.2,53.42 41.76,55.85 41.76,60.12 43.13,61.49 43.13,70.26 42.67,70.71 42.67,72.69 42.44,72.92 v42.44,75.06
  Bottom 0.152: IC5.36 28.8,74.61 28.8,77.42 29.49,78.11 39.32,78.11 40.92,76.5 40.92,76.05 41.38,75.59 41.83,75.59 42.37,75.06 v42.44,75.06
SDA_3V3  (via drill 0.3)
  Top 0.152: UART_I2C.8 42.9,50.65 42.9,53.87 41.45,55.32 41.45,60.27 42.82,61.65 42.82,70.1 42.37,70.56 42.37,72.54 41.91,73 41.91,75.89 v41.6,76.2
  Bottom 0.152: IC5.35 28.32,77.39 29.34,78.41 39.47,78.41 41.6,76.28 v41.6,76.2
TX_3V3  (via drill 0.3)
  Top 0.152: v41.38,75.06 41.38,73.08 42.06,72.39 42.06,70.41 42.52,69.95 42.52,61.8 41.15,60.43 41.15,44.42 48.23,37.34 v48.54,37.34
  Bottom 0.152: IC5.38 29.82,75.79 29.57,76.05 29.57,76.89 30.18,77.5 38.94,77.5 39.7,76.73 39.7,76.2 40.16,75.74 40.39,75.74 41.07,75.06 v41.38,75.06 | R23.1 45.88,26.89 45.26,27.51 45.26,28.96 47.02,30.71 47.62,30.71 50.52,33.6 50.52,35.43 48.62,37.34 v48.54,37.34
  Bottom 0.305: IC1.11 IC1.10 50.22,27.28 50.22,25.91 49.54,25.23 R22.2 R23.1
TX_232  (via drill 0.3)
  Top 0.152: UART_I2C.3 48.69,44.5 48.69,41.68 51.59,38.79 v51.59,37.34
  Bottom 0.152: IC1.14 55.32,33.07 51.59,36.8 v51.59,37.34
  Bottom 0.305: R22.1 46.72,23.55 48.62,23.55 49.07,24 49.99,24 50.9,24.92 54.71,24.92 55.32,25.53 IC1.14

### Text on the board
tPlace: Super_Unioc_NG V2 | Robotter